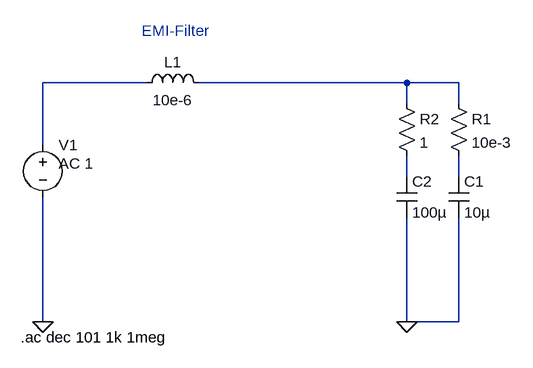
[diagram p0: schematic Input_capacitor_damping.asc]
Input_capacitor_damping.asc, the LTspice schematic file:
Version 4
SHEET 1 880 680
WIRE 160 -192 0 -192
WIRE 560 -192 240 -192
WIRE 640 -192 560 -192
WIRE 560 -160 560 -192
WIRE 640 -160 640 -192
WIRE 0 -96 0 -192
WIRE 560 -48 560 -80
WIRE 640 -48 640 -80
WIRE 0 176 0 -16
WIRE 560 176 560 16
WIRE 640 176 640 16
WIRE 640 176 560 176
FLAG 560 176 0
FLAG 0 176 0
SYMBOL res 624 -176 R0
SYMATTR InstName R1
SYMATTR Value 10e-3
SYMBOL cap 624 -48 R0
SYMATTR InstName C1
SYMATTR Value 10µ
SYMBOL cap 544 -48 R0
SYMATTR InstName C2
SYMATTR Value 100µ
SYMBOL res 544 -176 R0
SYMATTR InstName R2
SYMATTR Value 1
SYMBOL ind 144 -176 R270
WINDOW 0 32 56 VTop 2
WINDOW 3 5 56 VBottom 2
SYMATTR InstName L1
SYMATTR Value 10e-6
SYMATTR SpiceLine Rser=0.1
SYMBOL voltage 0 -112 R0
WINDOW 123 24 44 Left 2
WINDOW 39 0 0 Left 0
SYMATTR InstName V1
SYMATTR Value ""
SYMATTR Value2 AC 1
TEXT 152 -272 Left 2 ;EMI-Filter
TEXT -34 200 Left 2 !.ac dec 101 1k 1meg

The netlist it stands for:
* Input_capacitor_damping.asc
R1 N002 N004 10e-3
C1 N004 0 10µ
C2 N003 0 100µ
R2 N002 N003 1
L1 N001 N002 10e-6 Rser=0.1
V1 N001 0 AC 1
* EMI-Filter
.ac dec 101 1k 1meg
.backanno
.end